# EasyEDA Pro project pcb easy eda pro stm32wb5mmg01 - Elektor.eprj, board PCB6
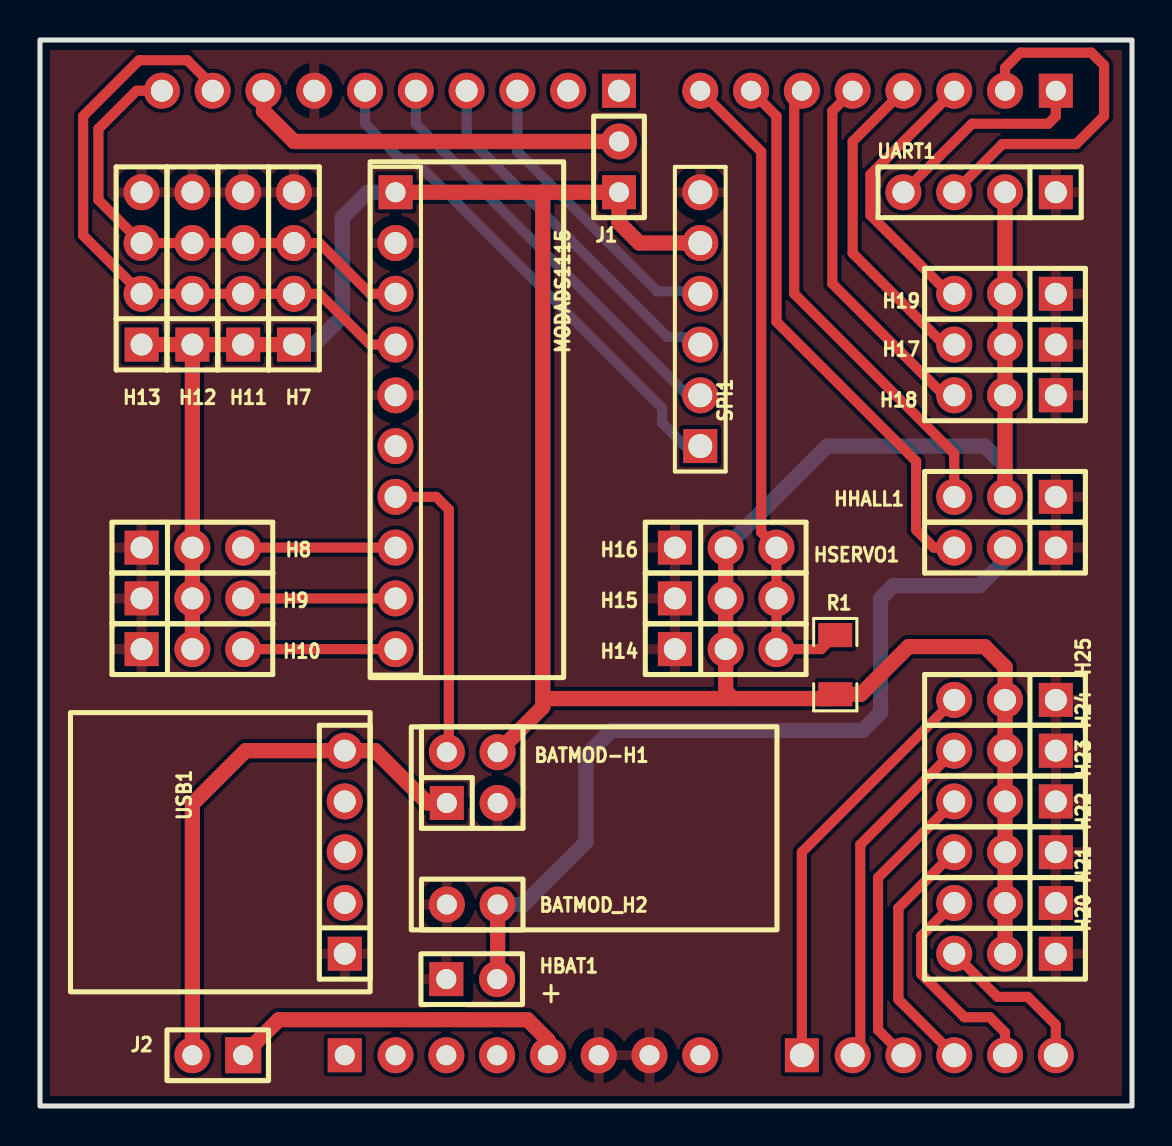
[diagram p7: board, top side]
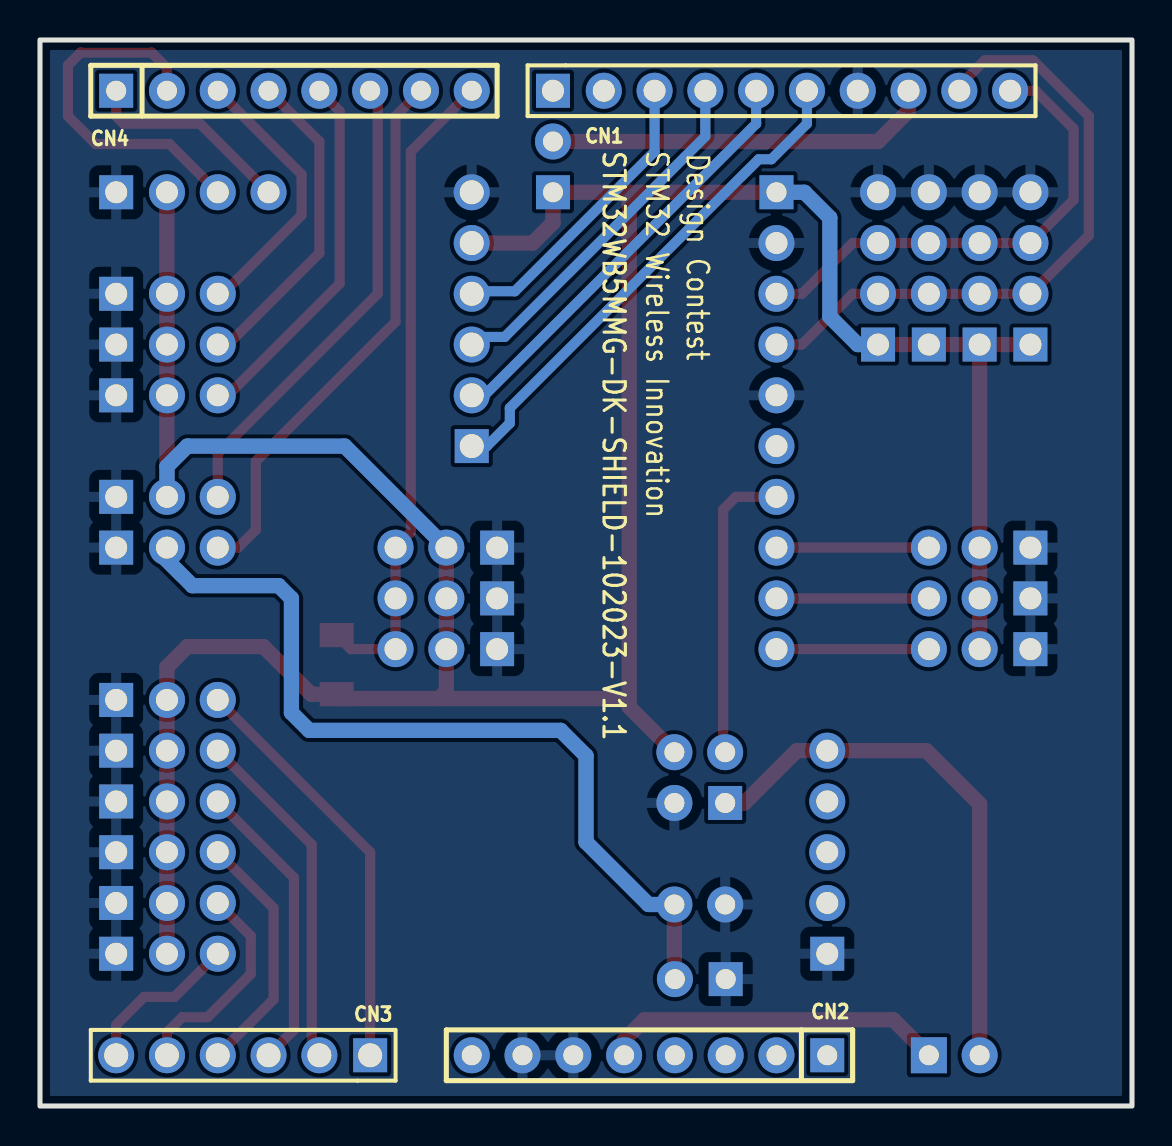
[diagram p8: board, bottom side, seen from below]

Outline 54.61 x 53.34 mm; copper layers: Top Layer, Bottom Layer. Coordinates in mm from the lower left corner of the outline.
Outline path: rectangle 0,53.34 54.61,0
Stack: Top Layer 0.035mm / Dielectric1 1.51mm FR4 er 4.5 / Bottom Layer 0.035mm

## Design rules (mm)
template: JLCPCB Capability(Two Layers Board)
spacing copperThickness1oz (default): track to track 0.102, other pairs 0.152 to 0.3
spacing copperThickness2oz: track to track 0.203, other pairs 0.152 to 0.3
track width copperThickness1oz (default): min 0.127, default 0.254, max 2.54
track width copperThickness2oz: min 0.203, default 0.254, max 2.54
differential pair differentialPair (default): width min 0.127, default 0.254, max 2.54; gap min 0.152, default 0.152
via viaSize (default): diameter min 0.5, default 0.61, max 10; hole min 0.3, default 0.305, max 6.3

## Placement (name value [footprint] x y rotation side)
BATMOD-H1  -  [hdr-th_4p-p2.54-v-m-r2-c2-s2.54-1]  21.62 16.43 0 top
BATMOD_H2  -  [hdr-th_2p-p2.54-v-m-1#2]  21.62 10.08 0 top
CN1  -  [hdr-th_10p-p2.54-v-m-1#2]  17.53 50.8 180 bottom
CN2  -  [hdr-th_8p-p2.54-v-m]  24.13 2.54 0 bottom
CN3  -  [hdr-th_6p-p2.54-v-m-1]  44.45 2.54 0 bottom
CN4  -  [hdr-th_8p-p2.54-v-m]  41.91 50.8 180 bottom
H7  -  [hdr-th_4p-p2.54-v-m]  12.7 41.91 90 top
H8  -  [hdr-th_3p-p2.54-v-m]  7.62 27.94 0 top
H9  -  [hdr-th_3p-p2.54-v-m]  7.62 25.4 0 top
H10  -  [hdr-th_3p-p2.54-v-m]  7.62 22.86 0 top
H11  -  [hdr-th_4p-p2.54-v-m]  10.16 41.91 90 top
H12  -  [hdr-th_4p-p2.54-v-m]  7.62 41.91 90 top
H13  -  [hdr-th_4p-p2.54-v-m]  5.08 41.91 90 top
H14  -  [hdr-th_3p-p2.54-v-m]  34.29 22.86 0 top
H15  -  [hdr-th_3p-p2.54-v-m]  34.29 25.4 0 top
H16  -  [hdr-th_3p-p2.54-v-m]  34.29 27.94 0 top
H17  -  [hdr-th_3p-p2.54-v-m]  48.26 38.1 180 top
H18  -  [hdr-th_3p-p2.54-v-m]  48.26 35.56 180 top
H19  -  [hdr-th_3p-p2.54-v-m]  48.26 40.64 180 top
H20  -  [hdr-th_3p-p2.54-v-m]  48.26 7.62 180 top
H21  -  [hdr-th_3p-p2.54-v-m]  48.26 10.16 180 top
H22  -  [hdr-th_3p-p2.54-v-m]  48.26 12.7 180 top
H23  -  [hdr-th_3p-p2.54-v-m]  48.26 15.24 180 top
H24  -  [hdr-th_3p-p2.54-v-m]  48.26 17.78 180 top
H25  -  [hdr-th_3p-p2.54-v-m]  48.26 20.32 180 top
HBAT1  -  [hdr-th_2p-p2.54-v-m-1]  21.59 6.35 0 top
HHALL1  -  [hdr-th_3p-p2.54-v-m]  48.26 30.48 180 top
HSERVO1  -  [hdr-th_3p-p2.54-v-m]  48.26 27.94 180 top
J1  -  [hdr-th_2p-p2.54-v-m-1]  28.96 46.99 90 top
J2  -  [HDR-TH_2P-P2.54-V-M-1]  8.89 2.54 180 top
MODADS1115  -  [hdr-th_10p-p2.54-v-m-1]  17.78 34.29 270 top
R1  4.7kΩ  [R1206]  39.77 22.08 270 top
SPI1  -  [hdr-th_6p-p2.54-v-m-1]  33.02 39.37 90 top
UART1  -  [hdr-th_4p-p2.54-v-m]  46.99 45.72 180 top
USB1  -  [hdr-th_5p-p2.54-v-m]  15.24 12.7 90 top

## Footprints (pads in the part's own frame, mm; a bottom-side part is the same pattern mirrored in y, then rotated)
hdr-th_2p-p2.54-v-m-1
  rect 1.7x1.7 hole 1.001: 1(-1.27,0)
  round 1.801 hole 1.001: 2(1.27,0)
hdr-th_2p-p2.54-v-m-1#2
  round 1.801 hole 1.001: 1(-1.27,0) 2(1.27,0)
HDR-TH_2P-P2.54-V-M-1
  rect 1.8x1.8 hole 1: 1(-1.27,0)
  round 1.8 hole 1: 2(1.27,0)
hdr-th_3p-p2.54-v-m
  rect 1.7x1.7 hole 1.1x1.001: 1(-2.54,0)
  round 1.801 hole 1.1x1.001: 2(0,0) 3(2.54,0)
hdr-th_4p-p2.54-v-m
  rect 1.7x1.7 hole 1.1x1.001: 1(-3.81,0)
  round 1.801 hole 1.1x1.001: 2(-1.27,0) 3(1.27,0) 4(3.81,0)
hdr-th_4p-p2.54-v-m-r2-c2-s2.54-1
  rect 1.7x1.7 hole 1.001: 1(-1.27,-1.27)
  round 1.801 hole 1.001: 2(-1.27,1.27) 3(1.27,-1.27) 4(1.27,1.27)
hdr-th_5p-p2.54-v-m
  rect 1.7x1.7 hole 1.1x1.001: 1(-5.08,0)
  round 1.801 hole 1.1x1.001: 2(-2.54,0) 3(0,0) 4(2.54,0) 5(5.08,0)
hdr-th_6p-p2.54-v-m-1
  rect 1.7x1.7 hole 1.2x1.001: 1(-6.35,0)
  round 1.801 hole 1.2x1.001: 2(-3.81,0) 3(-1.27,0) 4(1.27,0) 5(3.81,0) 6(6.35,0)
hdr-th_8p-p2.54-v-m
  rect 1.7x1.7 hole 1.001: 1(-8.89,0)
  round 1.801 hole 1: 2(-6.35,0) 3(-3.81,0) 4(-1.27,0) 5(1.27,0) 6(3.81,0) 7(6.35,0) 8(8.89,0)
hdr-th_10p-p2.54-v-m-1
  rect 1.7x1.7 hole 1.001x1.1: 1(-11.43,0)
  round 1.801 hole 1.1x1.001: 2(-8.89,0) 3(-6.35,0) 4(-3.81,0) 5(-1.27,0) 6(1.27,0) 7(3.81,0) 8(6.35,0) 9(8.89,0) 10(11.43,0)
hdr-th_10p-p2.54-v-m-1#2
  rect 1.7x1.7 hole 1.1: 1(-11.43,0)
  round 1.801 hole 1.1x1.001: 2(-8.89,0) 3(-6.35,0) 4(-3.81,0) 5(-1.27,0) 6(1.27,0) 7(3.81,0) 8(6.35,0) 9(8.89,0) 10(11.43,0)
R1206
  rect 1.208x1.701 smd: 1(-1.479,0) 2(1.479,0)

## Nets
As in the schematic.

Pads without a net: CN2 1

## Routing (per net, layer and track width the routed paths; a pad name or vN(x,y) marks a point on that pad's centre or on a via; arc(x,y) is an arc through that point)
3V3: length 159.9
  Top Layer w0.762: UART1.2 H19.2 H17.2 H18.2 HHALL1.2 ; 34.65,20.39 39.55,20.39 R1.2 41.05,20.61 43.43,22.99 47.24,22.99 48.26,21.97 H25.2 H24.2 H23.2 H22.2 H21.2 H20.2 ; 34.65,20.39 34.29,20.75 H14.2 H15.2 H16.2 ; 34.65,20.39 25.34,20.39 25.25,20.29 25.14,20.4 25.14,45.72 ; H10.2 H9.2 H8.2 H12.1 ; H7.1 H11.1 H12.1 ; H13.1 H12.1 ; BATMOD-H1.4 25.14,19.96 25.14,20.19 ; SPI1.5 29.97,43.18 28.96,44.2 J1.1 25.14,45.72 ; 25.14,45.72 MODADS1115.1
  Bottom Layer w0.762: MODADS1115.1 16.38,45.72 15.11,44.45 15.11,39.5 13.72,38.1 H7.1 ; HHALL1.2 48.26,32 47.24,33.02 39.37,33.02 H16.2
5V: length 17.2
  Top Layer w0.762: J2.1 11.94,4.32 24.38,4.32 25.4,3.3 CN2.5
AVDD: length 19.4
  Top Layer w0.762: CN1.8 11.18,49.78 12.7,48.26 J1.2
VBAT_IN: length 42.8
  Top Layer w0.762: BATMOD_H2.2 22.89,6.38 HBAT1.2
  Bottom Layer w0.762: BATMOD_H2.2 24.18,10.08 27.3,13.21 27.3,17.53 28.58,18.8 41.15,18.8 42.04,19.69 42.04,25.4 42.67,26.03 46.99,26.03 48.26,27.31 HSERVO1.2
VBUS: length 27.5
  Top Layer w0.762: J2.2 7.62,15.11 10.29,17.78 USB1.5 16.76,17.78 19.38,15.16 BATMOD-H1.1
AIN1: length 7.6
  Top Layer w0.508: H8.3 MODADS1115.8
AIN2: length 7.6
  Top Layer w0.508: H9.3 MODADS1115.9
AIN3: length 7.6
  Top Layer w0.508: H10.3 MODADS1115.10
PA1_SPI1_SCK: length 25.5
  Bottom Layer w0.508: SPI1.1 32.26,33.02 31.11,34.16 31.11,34.92 18.67,47.37 18.03,47.37 16.26,49.15 CN1.6
PA2: length 17.3
  Top Layer w0.508: H24.3 41.02,13.08 41.02,2.92 CN3.2
PA4_SPI1_NSS: length 15.1
  Bottom Layer w0.508: SPI1.4 32.89,40.77 30.86,40.77 23.88,47.75 CN1.3
PA5: length 14.8
  Top Layer w0.508: H23.3 41.91,11.43 41.91,3.81 CN3.3
PA7_SPI1_MOSI/TIM17_CH1: length 18.3
  Bottom Layer w0.508: SPI1.3 32.64,38.48 31.37,38.48 21.34,48.51 CN1.4
PA10_I2C1_SDA: length 32.3
  Top Layer w0.508: CN1.9 8.64,51.05 7.37,52.32 4.95,52.32 2.16,49.53 2.16,43.56 H13.2 H12.2 H11.2 H7.2 13.97,40.64 16.51,38.1 MODADS1115.4
PB2/ONEWIRE: length 32.7
  Top Layer w0.508: CN4.8 36.07,47.75 36.07,28.7 H16.3 H15.3 H14.3 39.07,22.86 39.77,23.56
PB4_SPI1_MISO: length 21.5
  Bottom Layer w0.508: SPI1.2 32.39,35.56 18.8,49.15 CN1.5
PB5_LPUART1_TX: length 18.3
  Top Layer w0.508: CN4.2 48.26,51.94 49.02,52.7 52.58,52.7 53.21,52.07 53.21,49.53 51.82,48.13 48.13,48.13 UART1.3
PB8_I2C1_SCL: length 24.3
  Top Layer w0.508: CN1.10 4.83,50.8 2.92,48.89 2.92,45.34 H13.3 H12.3 H11.3 H7.3 13.97,43.18 16.51,40.64 MODADS1115.3
PB10: length 23.8
  Top Layer w0.508: CN4.6 37.72,50.42 37.72,40.64 45.72,32.64 HHALL1.3
PC0_LPUART1_RX: length 10.5
  Top Layer w0.508: CN4.1 50.8,49.53 50.42,49.15 46.61,49.15 UART1.4
PC1: length 12.5
  Top Layer w0.508: H22.3 42.93,9.91 42.93,5.33 CN3.4
PC3: length 20.9
  Top Layer w0.508: CN3.1 38.1,12.7 H25.3
PC4: length 10.8
  Top Layer w0.508: CN3.5 48.26,3.68 47.5,4.44 46.23,4.44 44.07,6.6 44.07,8.51 H21.3
PC5: length 8.1
  Top Layer w0.508: CN3.6 50.8,4.06 49.4,5.46 47.88,5.46 H20.3
PD12_LPTIM2_IN1: length 13.8
  Top Layer w0.508: CN4.3 41.53,46.61 41.53,44.58 45.47,40.64 H19.3
PD14: length 16.2
  Top Layer w0.508: H17.3 45.21,38.1 40.64,42.67 40.64,48.26 CN4.4
PE0: length 27.7
  Top Layer w0.508: HSERVO1.3 44.7,27.94 43.81,28.83 43.81,32.26 36.83,39.24 36.83,49.53 CN4.7
PE4: length 18.5
  Top Layer w0.508: H18.3 45.21,35.56 39.62,41.15 39.62,49.78 CN4.5
VSENS: length 15.1
  Top Layer w0.508: MODADS1115.7 19.81,30.48 20.45,29.84 20.45,17.81 BATMOD-H1.2

## Copper pours and planes (outline as drawn; the poured copper is in the pictures)
GND on Top Layer: 0,53.34 54.61,53.34 54.61,0 0,0
GND on Bottom Layer: 0,53.34 54.61,53.34 54.61,0 0,0

## Text on the board
Bottom Silkscreen Layer: Design Contest | STM32 Wireless Innovation | STM32WB5MMG-DK-SHIELD-102023-V1.1
Document Layer: GND/GND/GND/GND / SCL/SCL/SCL/SCL / SDA/SDA/SDA/SDA / 3V3/3V3/3V3/3V3 | GND/3V3/AIN1 / GND/3V3/AIN2 / GND/3V3/AIN3 | USB VBUS IN / USB GND | GND/3V3/ONEWIRE / GND/3V3/ONEWIRE / GND/3V3/ONEWIRE | PC3 / 3V3 /GND / PA2 / 3V3 / GND / PA5 REL01/3V3/GND / PC1 REL02/3V3/GND / PC4/3V3/GND / PC5/VBATIN/GND | GND / 3V3 / SPI1 CS / SPI1 MOSI / SPI1 MISO / SPI1 SCK | LPTIM2_IN1/3V3/GND / PD14/3V3/GND / PE4/3V3/GND / PB10/3V3/GND / PE0/VBAT/GND | I2C1 SCL / I2C1 SDA / AVDD / GND / SPI1 SCK / SPI1 MISO / SPI1 MOSI / SPI1 CS / PD15 / PD13 | VIN / GND / GND / 5V / VCC STM / NRST / IOREF | PC5 / PC4 / PC1 REL02 / PA5 REL01 / PA2 / PC3 | PB2 ONEWIRE / PE0 / PB10 / PE4 / PD14 / PD12 LPTIM2 IN / PB5 LPUART1 TX / PC0 LPUART1 RX | RX / TX / 3V3 / GND
Top Silkscreen Layer: +
